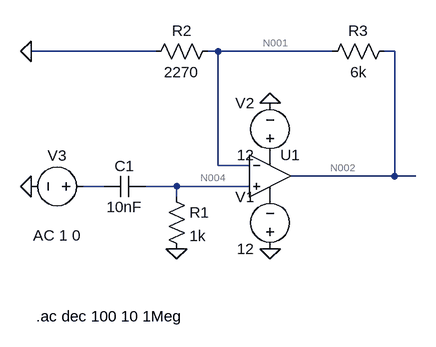
[diagram p0: schematic task2.asc]
task2.asc, the LTspice schematic file:
Version 4.1
SHEET 1 880 680
WIRE 80 0 -112 0
WIRE 176 0 160 0
WIRE 352 0 176 0
WIRE 448 0 432 0
WIRE 176 176 176 0
WIRE 224 176 176 176
WIRE 448 192 448 0
WIRE 448 192 288 192
WIRE 480 192 448 192
WIRE 0 208 -32 208
WIRE 112 208 64 208
WIRE 224 208 112 208
WIRE 112 224 112 208
FLAG 256 80 0
FLAG 256 304 0
FLAG 112 304 0
FLAG -112 208 0
FLAG -112 0 0
SYMBOL voltage 256 320 R180
WINDOW 0 24 96 Left 2
WINDOW 3 24 16 Left 2
SYMATTR InstName V1
SYMATTR Value 12
SYMBOL voltage 256 176 R180
WINDOW 0 24 96 Left 2
WINDOW 3 24 16 Left 2
SYMATTR InstName V2
SYMATTR Value 12
SYMBOL res 96 208 R0
SYMATTR InstName R1
SYMATTR Value 1k
SYMBOL cap 64 192 R90
WINDOW 0 0 32 VBottom 2
WINDOW 3 32 32 VTop 2
SYMATTR InstName C1
SYMATTR Value 10nF
SYMBOL voltage -16 208 R90
WINDOW 0 -32 56 VBottom 2
WINDOW 3 32 56 VTop 2
WINDOW 123 60 56 VTop 2
WINDOW 39 0 0 Left 0
SYMATTR InstName V3
SYMATTR Value ""
SYMATTR Value2 AC 1 0
SYMBOL res 176 -16 R90
WINDOW 0 0 56 VBottom 2
WINDOW 3 32 56 VTop 2
SYMATTR InstName R2
SYMATTR Value 2270
SYMBOL res 448 -16 R90
WINDOW 0 0 56 VBottom 2
WINDOW 3 32 56 VTop 2
SYMATTR InstName R3
SYMATTR Value 6k
SYMBOL OpAmps\\UniversalOpAmp 256 192 R0
SYMATTR InstName U1
TEXT -104 408 Left 2 !.ac dec 100 10 1Meg

The netlist it stands for:
* task2.asc
V1 0 P001 12
V2 P002 0 12
R1 N004 0 1k
C1 N004 N003 10nF
V3 N003 0 AC 1 0
R2 N001 0 2270
R3 N002 N001 6k
X§U1 N004 N001 P002 P001 N002 level1 Avol=1Meg GBW=10Meg Vos=0 En=0 Enk=0 In=0 Ink=0 Rin=500Meg  ; pins In+ In- V+ V- OUT
.ac dec 100 10 1Meg
.lib UniversalOpAmp1.lib
.backanno
.end

* Results of the author's LTspice run, read from the files saved beside the schematic
* Operating Point, zero values left out:
*   V(p001) = -12 V
*   V(p002) = 12 V
*   I(V1) = -24 nA
*   I(V2) = -24 nA
*   Ix(u1:3) = 24 nA
*   Ix(u1:4) = -24 nA
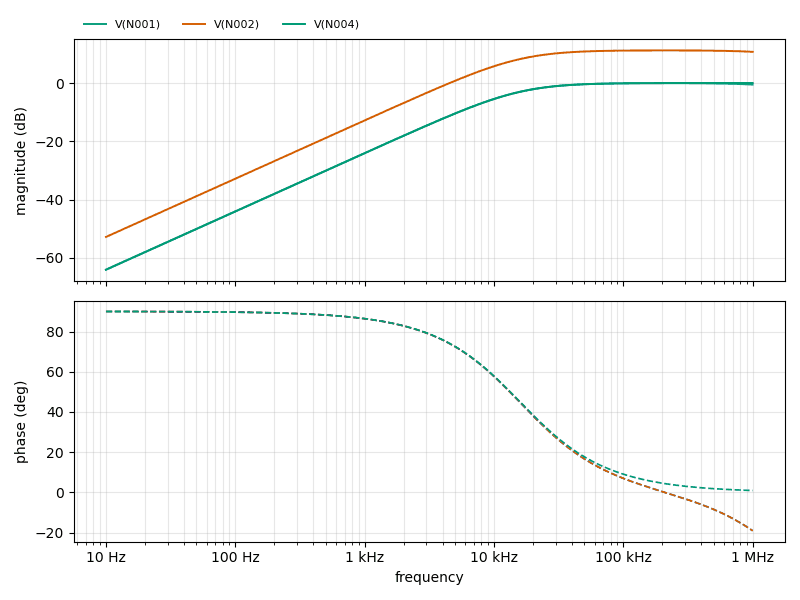
[diagram p1: AC Analysis of task2.asc, plotted from the saved traces]
* AC Analysis, 1 run:
*   V(N001): -64.04 dB at 10 Hz, -0.54 dB at 1 MHz, peak -0.05 dB at 208.9 kHz, 3 dB below the peak at 15.73 kHz
*   V(N002): -52.81 dB at 10 Hz, 10.69 dB at 1 MHz, peak 11.18 dB at 208.9 kHz, 3 dB below the peak at 15.73 kHz
*   V(N004): -64.04 dB at 10 Hz, -0.00 dB at 1 MHz, peak -0.00 dB at 1 MHz, 3 dB below the peak at 15.91 kHz